# Altium project VibinTest1.PrjPcb
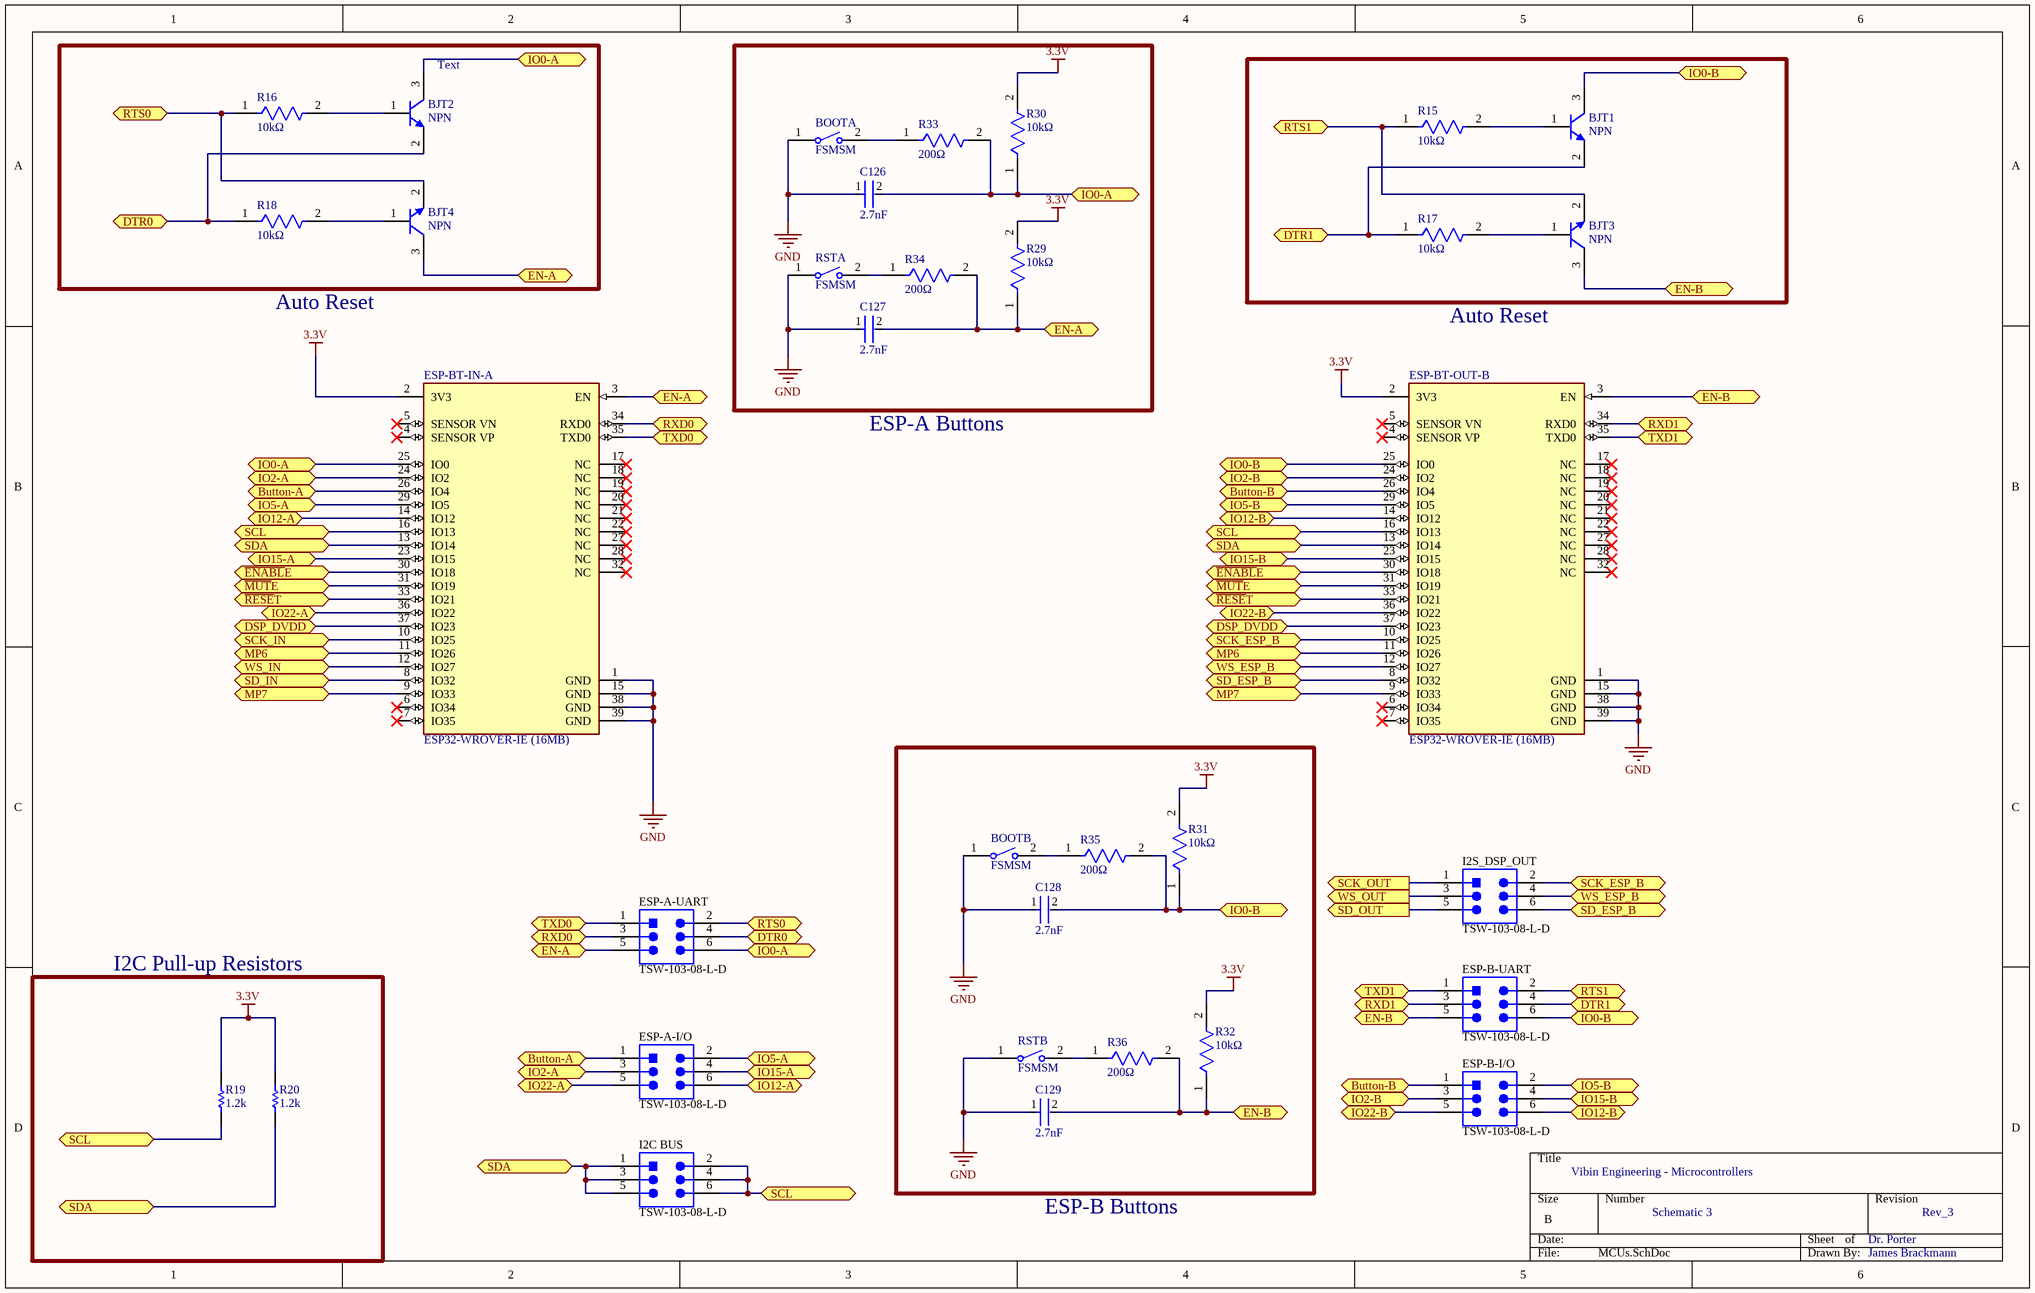
[diagram p0: MCUs.SchDoc]
2 sheets, 61 parts. Net scope: flat (ports and power ports of the same name join across sheets).
Board file: VibinDraft.PcbDoc
Sheets:
  MCUs.SchDoc
  Amplifier_1.SchDoc

## Sheet MCUs.SchDoc
size B; SheetNumber: 5; SheetTotal: 7

### Parts
BJT1  NPN  [ONSC-SOT-23-3-318-08_V]
BJT2  NPN  [ONSC-SOT-23-3-318-08_V]
BJT3  NPN  [ONSC-SOT-23-3-318-08_V]
BJT4  NPN  [ONSC-SOT-23-3-318-08_V]
BOOTA  FSMSM  [TECO-FSMSM-2_V]
BOOTB  FSMSM  [TECO-FSMSM-2_V]
C126  2.7nF  [FP-C0402-BB-MFG]
C127  2.7nF  [FP-C0402-BB-MFG]
C128  2.7nF  [FP-C0402-BB-MFG]
C129  2.7nF  [FP-C0402-BB-MFG]
ESP-A-I/O  TSW-103-08-L-D  [SMTC-TSW-103-08-L-D_V]
ESP-A-UART  TSW-103-08-L-D  [SMTC-TSW-103-08-L-D_V]
ESP-B-I/O  TSW-103-08-L-D  [SMTC-TSW-103-08-L-D_V]
ESP-B-UART  TSW-103-08-L-D  [SMTC-TSW-103-08-L-D_V]
ESP-BT-IN-A  ESP32-WROVER-IE (16MB)  [FP-ESP32-WROVER-IE_16MB-MFG]
ESP-BT-OUT-B  ESP32-WROVER-IE (16MB)  [FP-ESP32-WROVER-IE_16MB-MFG]
I2C_BUS  TSW-103-08-L-D  [SMTC-TSW-103-08-L-D_V]
I2S_DSP_OUT  TSW-103-08-L-D  [SMTC-TSW-103-08-L-D_V]
R15  10kΩ  [FP-RC0603-0_55-IPC_C]
R16  10kΩ  [FP-RC0603-0_55-IPC_C]
R17  10kΩ  [FP-RC0603-0_55-IPC_C]
R18  10kΩ  [FP-RC0603-0_55-IPC_C]
R19  1.2k  [RESC1608X55X25LL10T15]
R20  1.2k  [RESC1608X55X25LL10T15]
R29  10kΩ  [FP-RC0603-0_55-IPC_C]
R30  10kΩ  [FP-RC0603-0_55-IPC_C]
R31  10kΩ  [FP-RC0603-0_55-IPC_C]
R32  10kΩ  [FP-RC0603-0_55-IPC_C]
R33  200Ω  [FP-ERJ2RK-IPC_A]
R34  200Ω  [FP-ERJ2RK-IPC_A]
R35  200Ω  [FP-ERJ2RK-IPC_A]
R36  200Ω  [FP-ERJ2RK-IPC_A]
RSTA  FSMSM  [TECO-FSMSM-2_V]
RSTB  FSMSM  [TECO-FSMSM-2_V]

### Blocks framed on the sheet
Text: BJT2 BJT4 R16 R18
I2C Pull-up Resistors: R19 R20

### Ports
Button-A (bidir), Button-B (bidir), DSP_DVDD (bidir), DTR0 (bidir), DTR1 (bidir), EN-A (bidir), EN-B (bidir), IO0-A (bidir), IO0-B (bidir), IO2-A (bidir), IO2-B (bidir), IO5-A (bidir), IO5-B (bidir), IO12-A (bidir), IO12-B (bidir), IO15-A (bidir), IO15-B (bidir), IO22-A (bidir), IO22-B (bidir), MP6 (bidir), MP7 (bidir), RTS0 (bidir), RTS1 (bidir), RXD0 (bidir), RXD1 (bidir), SCK_ESP_B (bidir), SCK_IN (bidir), SCK_OUT (out), SCL (bidir), SD_ESP_B (bidir), SD_IN (bidir), SD_OUT (out), SDA (bidir), TXD0 (bidir), TXD1 (bidir), WS_ESP_B (bidir), WS_IN (bidir), WS_OUT (out), ~{ENABL}E (bidir), ~{MUT}E (bidir), ~{RESE}T (bidir)

### Nets
3.3V: ESP-BT-IN-A.2(3V3) ESP-BT-OUT-B.2(3V3) R19.2 R20.2 R29.2 R30.2 R31.2 R32.2
GND: BOOTA.1 BOOTB.1 C126.1 C127.1 C128.1 C129.1 ESP-BT-IN-A.1(GND) ESP-BT-IN-A.15(GND) ESP-BT-IN-A.38(GND) ESP-BT-IN-A.39(GND) ESP-BT-OUT-B.1(GND) ESP-BT-OUT-B.15(GND) ESP-BT-OUT-B.38(GND) ESP-BT-OUT-B.39(GND) RSTA.1 RSTB.1  [project net AVSS]
NetAMP1_27: ESP-BT-IN-A.16(IO13) ESP-BT-OUT-B.16(IO13) I2C_BUS.2 I2C_BUS.4 I2C_BUS.6 R19.1 ; port SCL
NetAMP1_30: ESP-BT-IN-A.13(IO14) ESP-BT-OUT-B.13(IO14) I2C_BUS.1 I2C_BUS.3 I2C_BUS.5 R20.1 ; port SDA
NetAMP1_33: ESP-BT-IN-A.30(IO18) ESP-BT-OUT-B.30(IO18) ; port ~{ENABL}E
NetAMP1_34: ESP-BT-IN-A.31(IO19) ESP-BT-OUT-B.31(IO19) ; port ~{MUT}E
NetBJT1_1: BJT1.1(B) R15.2
NetBJT1_2: BJT1.2(E) ESP-B-UART.4 R17.1 ; port DTR1
NetBJT1_3: BJT1.3(C) C128.2 ESP-B-UART.6 ESP-BT-OUT-B.25(IO0) R31.1 R35.2 ; port IO0-B
NetBJT2_1: BJT2.1(B) R16.2
NetBJT2_2: BJT2.2(E) ESP-A-UART.4 R18.1 ; port DTR0
NetBJT2_3: BJT2.3(C) C126.2 ESP-A-UART.6 ESP-BT-IN-A.25(IO0) R30.1 R33.2 ; port IO0-A
NetBJT3_1: BJT3.1(B) R17.2
NetBJT3_2: BJT3.2(E) ESP-B-UART.2 R15.1 ; port RTS1
NetBJT3_3: BJT3.3(C) C129.2 ESP-B-UART.5 ESP-BT-OUT-B.3(EN) R32.1 R36.2 ; port EN-B
NetBJT4_1: BJT4.1(B) R18.2
NetBJT4_2: BJT4.2(E) ESP-A-UART.2 R16.1 ; port RTS0
NetBJT4_3: BJT4.3(C) C127.2 ESP-A-UART.5 ESP-BT-IN-A.3(EN) R29.1 R34.2 ; port EN-A
NetBOOTA_2: BOOTA.2 R33.1
NetBOOTB_2: BOOTB.2 R35.1
NetESP-A-I/O_1: ESP-A-I/O.1 ESP-BT-IN-A.26(IO4) ; port Button-A
NetESP-A-I/O_2: ESP-A-I/O.2 ESP-BT-IN-A.29(IO5) ; port IO5-A
NetESP-A-I/O_3: ESP-A-I/O.3 ESP-BT-IN-A.24(IO2) ; port IO2-A
NetESP-A-I/O_4: ESP-A-I/O.4 ESP-BT-IN-A.23(IO15) ; port IO15-A
NetESP-A-I/O_5: ESP-A-I/O.5 ESP-BT-IN-A.36(IO22) ; port IO22-A
NetESP-A-I/O_6: ESP-A-I/O.6 ESP-BT-IN-A.14(IO12) ; port IO12-A
NetESP-A-UART_1: ESP-A-UART.1 ESP-BT-IN-A.35(TXD0) ; port TXD0
NetESP-A-UART_3: ESP-A-UART.3 ESP-BT-IN-A.34(RXD0) ; port RXD0
NetESP-B-I/O_1: ESP-B-I/O.1 ESP-BT-OUT-B.26(IO4) ; port Button-B
NetESP-B-I/O_2: ESP-B-I/O.2 ESP-BT-OUT-B.29(IO5) ; port IO5-B
NetESP-B-I/O_3: ESP-B-I/O.3 ESP-BT-OUT-B.24(IO2) ; port IO2-B
NetESP-B-I/O_4: ESP-B-I/O.4 ESP-BT-OUT-B.23(IO15) ; port IO15-B
NetESP-B-I/O_5: ESP-B-I/O.5 ESP-BT-OUT-B.36(IO22) ; port IO22-B
NetESP-B-I/O_6: ESP-B-I/O.6 ESP-BT-OUT-B.14(IO12) ; port IO12-B
NetESP-B-UART_1: ESP-B-UART.1 ESP-BT-OUT-B.35(TXD0) ; port TXD1
NetESP-B-UART_3: ESP-B-UART.3 ESP-BT-OUT-B.34(RXD0) ; port RXD1
NetESP-BT-IN-A_8: ESP-BT-IN-A.8(IO32) ; port SD_IN
NetESP-BT-IN-A_9: ESP-BT-IN-A.9(IO33) ESP-BT-OUT-B.9(IO33) ; port MP7
NetESP-BT-IN-A_10: ESP-BT-IN-A.10(IO25) ; port SCK_IN
NetESP-BT-IN-A_11: ESP-BT-IN-A.11(IO26) ESP-BT-OUT-B.11(IO26) ; port MP6
NetESP-BT-IN-A_12: ESP-BT-IN-A.12(IO27) ; port WS_IN
NetESP-BT-IN-A_33: ESP-BT-IN-A.33(IO21) ESP-BT-OUT-B.33(IO21) ; port ~{RESE}T
NetESP-BT-IN-A_37: ESP-BT-IN-A.37(IO23) ESP-BT-OUT-B.37(IO23) ; port DSP_DVDD
NetESP-BT-OUT-B_8: ESP-BT-OUT-B.8(IO32) I2S_DSP_OUT.6 ; port SD_ESP_B
NetESP-BT-OUT-B_10: ESP-BT-OUT-B.10(IO25) I2S_DSP_OUT.2 ; port SCK_ESP_B
NetESP-BT-OUT-B_12: ESP-BT-OUT-B.12(IO27) I2S_DSP_OUT.4 ; port WS_ESP_B
NetI2S_DSP_OUT_1: I2S_DSP_OUT.1 ; port SCK_OUT
NetI2S_DSP_OUT_3: I2S_DSP_OUT.3 ; port WS_OUT
NetI2S_DSP_OUT_5: I2S_DSP_OUT.5 ; port SD_OUT
NetR34_1: R34.1 RSTA.2
NetR36_1: R36.1 RSTB.2

Not connected (* = marked no-connect by the designer): ESP-BT-IN-A 4(SENSOR_VP)* 5(SENSOR_VN)* 6(IO34)* 7(IO35)* 17(NC)* 18(NC)* 19(NC)* 20(NC)* 21(NC)* 22(NC)* 27(NC)* 28(NC)* 32(NC)*; ESP-BT-OUT-B 4(SENSOR_VP)* 5(SENSOR_VN)* 6(IO34)* 7(IO35)* 17(NC)* 18(NC)* 19(NC)* 20(NC)* 21(NC)* 22(NC)* 27(NC)* 28(NC)* 32(NC)*

### Notes on the sheet
- Auto Reset
- ESP-A Buttons
- Vibin Engineering - Microcontrollers
- ESP-B Buttons
- Schematic 3
- Dr. Porter
- Rev_3
- James Brackmann

### Library data of the parts
BJT1-BJT4 = CMP-1048-00627-1: Amplifier Transistor, NPN Silicon, 3-Pin SOT-23, Pb-Free, Tape and Reel       NSVMMBT6429LT1G; Manufacturer: On Semiconductor; IC Continuous (A): 0.2; fT Min (MHz): 100; ComponentLink3URL: http://www.onsemi.cn/pub_link/Collateral/318-08.PDF; Mounting Technology: Surface Mount; ComponentLink2Description: Datasheet; Polarity: NPN; DatasheetVersion: Rev. 6; PackageReference: SOT-23-3-318-08; Packing: Tape and Reel; PackageVersion: Rev. AP, 11/2009; ComponentLink1URL: http://www.onsemi.com/; ComponentLink3Description: Package Specification; RoHS: TRUE; PackageDescription: 3-Pin Small Outline Transistor, Body 2.92 x 1.3 mm, Pitch 0.95 mm; ComponentLink2URL: http://www.onsemi.com/pub_link/Collateral/MMBT6428LT1-D.PDF; PartNumber: NSVMMBT6429LT1G; ComponentLink1Description: Manufacturer URL
BOOTA BOOTB RSTA RSTB = CMP-2000-07511-1: FSMSM Push Button Switch, 50 mA, -35 to 85 degC, 2-Pin SMD, RoHS, Bulk        506-FSMSM; Manufacturer: TE Connectivity; Actuator Length: 1.07mm; Electrical Life: 20000Cycles; Actuator Material: Polyamide; Current Rating: 50mA; Illumination Type: Illuminated; Voltage Rating (DC): 24V; Contact Resistance: 100mOhm; Case\/Package: SMD/SMT; Operating Force: 180gf; Switch Travel: 0.25mm; Max Voltage Rating (DC): 12V; Throw Configuration: SPST; Packaging: LoosePiece; Max Operating Temperature: 85degC; ELV: Compliant; Package Description: 2-Pin Surface Mount Device, Body 6 x 3.5 mm, Pitch 9.19 mm; RoHSCompliant: true; Manufacturer URL: http://www.te.com/; Contact Plating: Silver; Contact Material: Brass; Mounting Technology: SurfaceMount; Contact Current Rating: 50mA; Datasheet Version: Rev. C2, 08/2014; Datasheet URL: http://www.te.com/commerce/DocumentDelivery/DDEController?Action=showdoc&DocId=Customer+Drawing%7F1437566-3%7FC2%7Fpdf%7FEnglish%7FENG_CD_1437566-3_C2_1437566_3_1_c.dwg.pdf%7F1437566-3; Mechanical Life: 20000Cycles; Package Reference: FSMSM; REACH SVHC: Unknown; Orientation: Straight; Min Operating Temperature: -35degC; Lead Free: LeadFree; Termination: GullWing; Package Quantity: 1000; Mount: SurfaceMount
C126-C129 = CMP-2008-03164-3: C0402 2,700 pF X7R 5.00% 10 V        C0402C272J8RACAUTO; Manufacturer: Kemet; Material: Ceramic; Tolerance: 0.05; Temperature Coefficient: 15%; Voltage Rating: 10 V; Octopart: https://octopart.com/c0402c272j8racauto-kemet-16435644; Manufacturer Part Number: C0402C272J8RACAUTO; Device Class L2: Capacitors; Temperature Range Low: -55°C; Mouser Description: Cap Ceramic 0.0027uF 10V X7R 5% SMD 0402 125°C Bulk; Ipc Land Pattern Name: CAPC10050X50; Device Class L3: Ceramic Capacitors; Lead Free: Yes; Temperature Range High: +125°C; Automotive: No; ComponentLink2URL: https://content.kemet.com/datasheets/KEM_C1002_X7R_SMD.pdf; Temperature: -55°C to +125°C; Height: 0.55mm; RoHS: TRUE; Value: 2,700 pF; Package: C0402-BB; Temperature Characteristic: X7R; Device Class L1: Passive Components; Category: Cap; Capacitance: 2,700 pF; ComponentLink2Description: Datasheet
ESP-A-I/O ESP-A-UART ESP-B-I/O ESP-B-UART I2C_BUS I2S_DSP_OUT = CMP-1024-00336-5: Male Header, Pitch 2.54 mm, 2 x 3 Position, Height 8.38 mm, Tail Length 5.08 mm, -55 to 125 degC, RoHS, Bulk; Manufacturer: Samtec; DatasheetVersion: 04/2012; ComponentLink3URL: http://suddendocs.samtec.com/prints/tsw-xxx-xx-x-x-xx-xxx-footprint.pdf; PackageReference: TSW-103-08-L-D; Mounting Technology: Through Hole; Min Operating Temperature: -55 degC; ComponentLink2Description: Datasheet; Lead Pitch: 2.54 mm; ComponentLink1Description: Manufacturer URL; Mount: Through Hole; ComponentLink1URL: http://www.samtec.com/; ComponentLink3Description: Package Specification; Max Operating Temperature: 125 degC; PackageDescription: Male Header, Pitch 2.54 mm, 2 x 3 Position, Height 8.38 mm, Tail Length 5.08 mm; ComponentLink2URL: https://datasheet.ciiva.com/25618/0900766b81154476-25618436.pdf; RoHSCompliant: true
ESP-BT-IN-A ESP-BT-OUT-B = CMP-194065-000028-1: RX TXRX MOD WIFI EXT IPEX SMD
R15 R16 = CMP-2100-03664-2: RES 10K OHM 1% 1/10W 0603        RC0603FR-0710KL; Voltage Rating: 75V; Voltage Rating (DC): 50V; Resistance: 10kR; Power Rating: 100mW; Temperature Coefficient: 100ppm/°C; Depth: 0.8mm; Termination: SMD/SMT; Resistor Type: Thick Film; Series: RC; Construction: Rectangular; Features: Moisture Resistant; Packaging: Tape and Reel; Min Operating Temperature: -55°C; Number of Terminations: 2; Lead Pitch: 0.3mm; RoHS Compliant: Yes; Case/Package: 0603; Resistance Tolerance: 1%; Military Standard: Not; Weight: 7.1E-05oz; Number of Pins: 2; Tolerance: 1%; Length: 1.6mm; Case Code (Imperial): 0603; Lead Free: Lead Free; Width: 0.8mm; Max Power Dissipation: 100mW; Height: 0.45mm; Max Operating Temperature: 155°C; Case Code (Metric): 1608; Size Code: 0603
R17 R18 R29-R32 = CMP-2100-03664-2: RES 10K OHM 1% 1/10W 0603      RC0603FR-0710KL; Voltage Rating: 75V; Voltage Rating (DC): 50V; Resistance: 10kR; Power Rating: 100mW; Temperature Coefficient: 100ppm/°C; Depth: 0.8mm; Termination: SMD/SMT; Resistor Type: Thick Film; Series: RC; Construction: Rectangular; Features: Moisture Resistant; Packaging: Tape and Reel; Min Operating Temperature: -55°C; Number of Terminations: 2; Lead Pitch: 0.3mm; RoHS Compliant: Yes; Case/Package: 0603; Resistance Tolerance: 1%; Military Standard: Not; Weight: 7.1E-05oz; Number of Pins: 2; Tolerance: 1%; Length: 1.6mm; Case Code (Imperial): 0603; Lead Free: Lead Free; Width: 0.8mm; Max Power Dissipation: 100mW; Height: 0.45mm; Max Operating Temperature: 155°C; Case Code (Metric): 1608; Size Code: 0603
R19 R20 = CMP-1659-00042-1: Chip Resistor, 1.2 KOhm, +/- 1%, 0.1 W, -55 to 155 degC, 0603 (1608 Metric), RoHS, Tape and Reel         RC0603FR-071K2L; Resistance: 825 kohm; Voltage Rating: 50 V; Power Rating: 100 mW; Case\Package: 0603; DatasheetVersion: Rev. 4, 02/2016; Package Quantity: 5000; Min Operating Temperature: -55 degC; PackageReference: 0603; ComponentLink1Description: Manufacturer URL; Tolerance: 1%; ComponentLink2Description: Datasheet; Packaging: Tape and Reel; PackageDescription: 2-Pin Surface Mount Device, Body 1.6 x 0.8 mm; Width: 0.8 mm; ComponentLink2URL: http://www.yageo.com/documents/recent/PYu-RC_Group_51_RoHS_L_04.pdf; ComponentLink1URL: http://www.yageo.com/; Max Operating Temperature: 155 degC; RoHSCompliant: true; Height: 0.45 mm; Case Code (Imperial): 0603; Case Code (Metric): 1608; Length: 1.6 mm
R33-R36 = CMP-2002-00757-2: RES SMD 200 OHM 1% 1/10W 0402    ERJ-2RKF2000X; Power Rating: 100mW; Voltage Rating (DC): 50V; Resistance: 200R; Temperature Coefficient: 100ppm/°C; RoHS Compliant: Yes; Packaging: Tape and Reel; Case Code (Metric): 1005; Package Quantity: 1; Contact Plating: Tin; Series: ERJ; Mount: Surface Mount; Lead Free: Lead Free; Min Operating Temperature: -55°C; Number of Terminations: 2; Max Power Dissipation: 100mW; Technology: THICK FILM; Voltage Rating: 50V; Case/Package: 0402; Width: 0.02inch; Termination: SMD/SMT; Military Standard: Not; Height: 0.35mm; Radiation Hardening: No; Resistance Tolerance: 1%; Length: 1mm; REACH SVHC: No SVHC; Construction: Rectangular; Depth: 0.5mm; Features: Automotive AEC-Q200; Resistor Type: Thick Film; Case Code (Imperial): 0402; Tolerance: 1%; Size Code: 0402; Max Operating Temperature: 155°C

## Sheet Amplifier_1.SchDoc
size B; SheetNumber: 2; SheetTotal: 7; SPICEModelCacheXOIHOEUF: <root> / <DocumentId>XOIHOEUF</DocumentId> / </root>
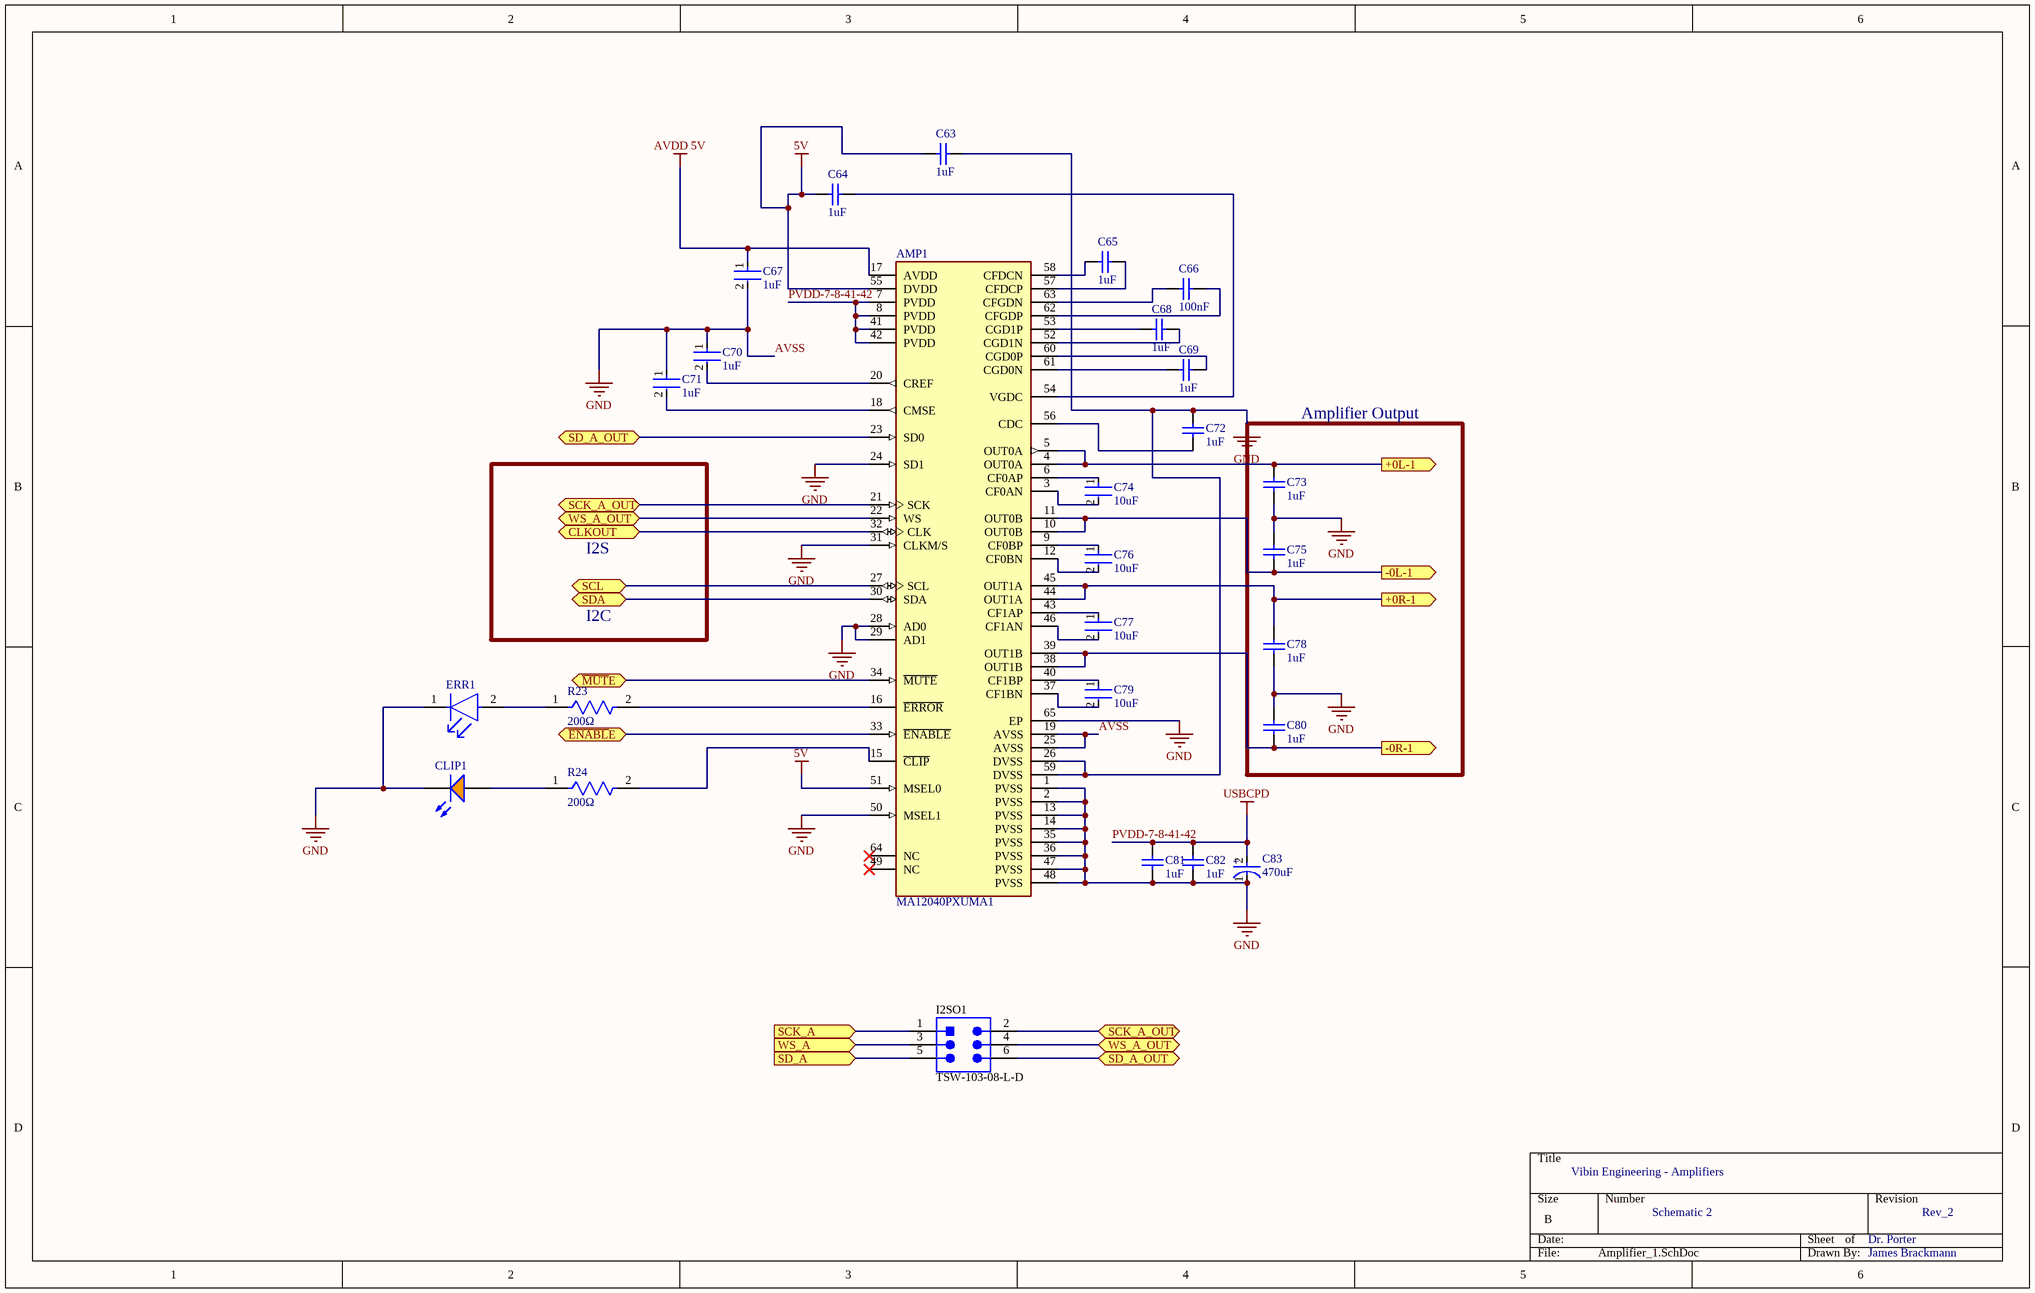
[diagram p1: Amplifier_1.SchDoc]

### Parts
AMP1  MA12040PXUMA1  [FP-PG-VQFN-64-IPC_B]
C63  1uF  [CAPC1608X90X35LL15T15]
C64  1uF  [CAPC1608X90X35LL15T15]
C65  1uF  [CAPC1608X90X35LL15T15]
C66  100nF  [CAPC1608X90X35ML10T15]
C67  1uF  [FP-GRM15-0_1-MFG]
C68  1uF  [CAPC1608X90X35LL15T15]
C69  1uF  [CAPC1608X90X35LL15T15]
C70  1uF  [FP-GRM15-0_1-MFG]
C71  1uF  [FP-GRM15-0_1-MFG]
C72  1uF  [CAPC1608X90X35LL15T15]
C73  1uF  [CAPC1608X90X35LL15T15]
C74  10uF  [FP-1210-L_3_3_0_4-W_2_5_0-MFG]
C75  1uF  [CAPC1608X90X35LL15T15]
C76  10uF  [FP-1210-L_3_3_0_4-W_2_5_0-MFG]
C77  10uF  [FP-1210-L_3_3_0_4-W_2_5_0-MFG]
C78  1uF  [CAPC1608X90X35LL15T15]
C79  10uF  [FP-1210-L_3_3_0_4-W_2_5_0-MFG]
C80  1uF  [CAPC1608X90X35LL15T15]
C81  1uF  [CAPC1608X90X35LL15T15]
C82  1uF  [CAPC1608X90X35LL15T15]
C83  470uF  [FP-OS-CON-SMT-E12-MFG]
CLIP1  TLMO1100-GS08  [VISH-TLMX1100-2_V]  (value not drawn)
ERR1  LTST-C190GKT  [FP-LTST-C190GKT-MFG]  (value not drawn)
I2SO1  TSW-103-08-L-D  [SMTC-TSW-103-08-L-D_V]
R23  200Ω  [FP-ERJ2RK-IPC_A]
R24  200Ω  [FP-ERJ2RK-IPC_A]

### Blocks framed on the sheet
Amplifier Output: C73 C75 C78 C80

### Ports
+0L-1 (out), +0R-1 (out), -0L-1 (out), -0R-1 (out), CLKOUT (bidir), SCK_A (in), SCK_A_OUT (bidir), SCL (bidir), SD_A (in), SD_A_OUT (bidir), SDA (bidir), WS_A (in), WS_A_OUT (bidir), ~{ENABL}E (bidir), ~{MUT}E (bidir)

### Nets
5V: AMP1.51(MSEL0) AMP1.55(DVDD) C63.2 C64.1
AVDD 5V: AMP1.17(AVDD) C67.1
AVSS: AMP1.1(PVSS) AMP1.2(PVSS) AMP1.13(PVSS) AMP1.14(PVSS) AMP1.19(AVSS) AMP1.24(SD1) AMP1.25(AVSS) AMP1.26(DVSS) AMP1.28(AD0) AMP1.29(AD1) AMP1.31(CLKM/S) AMP1.35(PVSS) AMP1.36(PVSS) AMP1.47(PVSS) AMP1.48(PVSS) AMP1.50(MSEL1) AMP1.59(DVSS) AMP1.65(EP) C63.1 C67.2 C70.1 C71.1 C72.1 C73.2 C75.1 C78.2 C80.1 C81.2 C82.2 C83.1(C) CLIP1.2(K) ERR1.1(C)  [also labelled GND]
PVDD-7-8-41-42: AMP1.7(PVDD) AMP1.8(PVDD) AMP1.41(PVDD) AMP1.42(PVDD) C81.1 C82.1 C83.2(A)  [also labelled USBCPD]
NetAMP1_3: AMP1.3(CF0AN) C74.2
NetAMP1_4: AMP1.4(OUT0A) AMP1.5(OUT0A) C73.1 ; port +0L-1
NetAMP1_6: AMP1.6(CF0AP) C74.1
NetAMP1_9: AMP1.9(CF0BP) C76.1
NetAMP1_10: AMP1.10(OUT0B) AMP1.11(OUT0B) C75.2 ; port -0L-1
NetAMP1_12: AMP1.12(CF0BN) C76.2
NetAMP1_15: AMP1.15(~{CLIP}) R24.2
NetAMP1_16: AMP1.16(~{ERROR}) R23.2
NetAMP1_18: AMP1.18(CMSE) C71.2
NetAMP1_20: AMP1.20(CREF) C70.2
NetAMP1_21: AMP1.21(SCK) I2SO1.2 ; port SCK_A_OUT
NetAMP1_22: AMP1.22(WS) I2SO1.4 ; port WS_A_OUT
NetAMP1_23: AMP1.23(SD0) I2SO1.6 ; port SD_A_OUT
NetAMP1_27: AMP1.27(SCL) ; port SCL
NetAMP1_30: AMP1.30(SDA) ; port SDA
NetAMP1_32: AMP1.32(CLK) ; port CLKOUT
NetAMP1_33: AMP1.33(~{ENABLE}) ; port ~{ENABL}E
NetAMP1_34: AMP1.34(~{MUTE}) ; port ~{MUT}E
NetAMP1_37: AMP1.37(CF1BN) C79.2
NetAMP1_38: AMP1.38(OUT1B) AMP1.39(OUT1B) C80.2 ; port -0R-1
NetAMP1_40: AMP1.40(CF1BP) C79.1
NetAMP1_43: AMP1.43(CF1AP) C77.1
NetAMP1_44: AMP1.44(OUT1A) AMP1.45(OUT1A) C78.1 ; port +0R-1
NetAMP1_46: AMP1.46(CF1AN) C77.2
NetAMP1_52: AMP1.52(CGD1N) C68.1
NetAMP1_53: AMP1.53(CGD1P) C68.2
NetAMP1_54: AMP1.54(VGDC) C64.2
NetAMP1_56: AMP1.56(CDC) C72.2
NetAMP1_57: AMP1.57(CFDCP) C65.1
NetAMP1_58: AMP1.58(CFDCN) C65.2
NetAMP1_60: AMP1.60(CGD0P) C69.1
NetAMP1_61: AMP1.61(CGD0N) C69.2
NetAMP1_62: AMP1.62(CFGDP) C66.1
NetAMP1_63: AMP1.63(CFGDN) C66.2
NetCLIP1_1: CLIP1.1(A) R24.1
NetERR1_2: ERR1.2(A) R23.1
NetI2SO1_1: I2SO1.1 ; port SCK_A
NetI2SO1_3: I2SO1.3 ; port WS_A
NetI2SO1_5: I2SO1.5 ; port SD_A

Not connected (* = marked no-connect by the designer): AMP1 49(NC)* 64(NC)*

### Notes on the sheet
- I2S
- I2C
- Vibin Engineering - Amplifiers
- Schematic 2
- Dr. Porter
- Rev_2
- James Brackmann
- (in symbol CMP-05428-001033-1) +

### Library data of the parts
AMP1 = CMP-32833-000001-1: IC AMP CLASS D STEREO 40W 64QFN; Manufacturer: Infineon; Max Junction Temp: +150°C; Max Supply Voltage: 18V; Output Current Per Channel: 6A; Number Of Channels: 1; Min Supply Voltage: 4V; Nominal Supply Current: 6-38mA; Power At Speaker R: 20W @ 8Ω; Ambient Temperature Range High: +85°C; Ambient Temperature Range Low: 0°C; RoHS: TRUE; Temperature: -40°C to +150°C; Device Class L1: Integrated Circuits (ICs); Height: 0.9mm; Lead Free: Yes; Octopart: https://octopart.com/ma12040pxuma1-infineon-95984592; ComponentLink2URL: https://www.infineon.com/dgdl/Infineon-MA12040P-DS-v01_00-EN.pdf?fileId=5546d46264a8de7e0164b74ff0e561a2; Category: IC; Manufacturer Part Number: MA12040PXUMA1; Temperature Range High: +150°C; Ipc Land Pattern Name: QFN50P900X900X90-64; Automotive: No; Digikey Description: IC AMP CLASS D STEREO 40W 64QFN; Device Class L2: Linear ICs; Device Class L3: Amplifiers - Audio; Temperature Range Low: -40°C; Footprint Url: https://www.infineon.com/cms/en/product/packages/PG-VQFN/PG-VQFN-64-6/; ComponentLink2Description: Datasheet; Package: PG-VQFN-64
C63-C65 C68 C69 C72 C73 C75 C78 C80-C82 = CMP-2006-02298-2: C0603C105K4RACTU; Manufacturer: Kemet; Part Number: C0603C105K4RACTU
C66 = CMP-2100-03643-1: Chip Capacitor, 0.1 uF, +/- 10%, 50 V, -55 to 125 degC, 0603 (1608 Metric), RoHS, Tape and Reel              GRM188R71H104KA93D; Manufacturer: Murata; Dielectric Material: Ceramic; Voltage Rating: 50V; Dielectric: X7R; Insulation Resistance: 10GR; Case Code (Metric): 1608; Lead Free: LeadFree; Depth: 0.8mm; Number of Pins: 2; Radiation Hardening: No; Case/Package: 0603; Manufacturer URL: http://www.murata.com/; Packaging: TapeandReel; Length: 1.6mm; Contact Plating: Tin; Datasheet URL: http://psearch.en.murata.com/capacitor/product/GRM188R71H104KA93%23.pdf; Tolerance: 10%; Case Code (Imperial): 0603; Min Operating Temperature: -55degC; RoHSCompliant: true; Capacitance: 100nF; Voltage: 50V; Termination: SMD/SMT; Mount: SurfaceMount; Material: Ceramic; Package Quantity: 1; Height: 0.8mm; Thickness: 0.035inch; REACH SVHC: NoSVHC; Max Operating Temperature: 125degC; Width: 0.8mm; Package Reference: 0603; Voltage Rating (DC): 50V; Datasheet Version: 42675.0; Package Description: 2-Pin Surface Mount Device, Body 1.6 x 0.8 mm
C67 C70 C71 = CMP-2008-04556-2: CAP CER 1UF 10V X5R 0402         GRM155R61A105KE15D; Manufacturer: Murata; Material: Ceramic; Tolerance: 10%; Temperature Coefficient: 15%; Octopart: https://octopart.com/grm155r61a105ke15d-murata-197442; Manufacturer Part Number: GRM155R61A105KE15D; Lead Free: Yes; ComponentLink2Description: Datasheet; Temperature: -55°C to +85°C; Temperature Range High: +85°C; Height: 0.55mm; Capacitance: 1uF; Ipc Land Pattern Name: CAPC10050X50; ComponentLink2URL: https://search.murata.co.jp/Ceramy/image/img/A01X/G101/ENG/GRM155R61A105KE15-01A.pdf; Temperature Range Low: -55°C; Device Class L2: Capacitors; Voltage Rating: 10V; RoHS: TRUE; Device Class L1: Passive Components; Device Class L3: Ceramic Capacitors; Temperature Characteristic: X5R; Mouser Description: 0402 1 uF 10 V ±10% Tolerance X5R Surface Mount Multilayer Ceramic Capacitor; Automotive: No; Package: GRM15-0.1; Digikey Description: CAP CER 1UF 10V X5R 0402; Value: 1uF; Category: Cap
C74 C76 C77 C79 = CMP-2000-05477-2: General Purpose Ceramic Capacitor, 1210, 10uF, 10%, X5R, 15%, 25V        12103D106KAT2A; Lead Free: Lead Free; Max Operating Temperature: 85°C; REACH SVHC: No SVHC; Depth: 2.5mm; Packaging: Tape and Reel; Min Operating Temperature: -55°C; Height: 2.29mm; Construction: Flat; Case Code (Imperial): 1210; Radiation Hardening: No; Voltage: 25V; Case/Package: 1210; Series: -; Dielectric: X5R; Length: 3.2mm; Thickness: 0.11inch; Package Quantity: 1; Termination: SMD/SMT; Case Code (Metric): 3225; Voltage Rating (DC): 25V; Voltage Rating: 25V; Contact Plating: Tin; RoHS Compliant: Yes; Mount: Surface Mount; Width: 0.098inch; Capacitance: 10uF; Tolerance: 10%
C83 = CMP-05428-001033-1: Conductive Polymer Aluminum Solid Capacitors (OS-CON) 470uF ±20% 20V      20SVPK470M; ESR (Equivalent Series Resistance): 14mR; Life (Hours): 1000Hour; Capacitance: 470uF; Mount: Surface Mount; Max Operating Temperature: 125°C; Min Operating Temperature: -55°C; Case/Package: Radial; Tolerance: 20%; Voltage Rating: 20V; Packaging: Tape and Reel
CLIP1 = CMP-1666-00029-1: Orange LED, 20 mA, 2.1 V, -40 to 100 degC, 2-Pin SMD (0603), RoHS, Tape and Reel           TLMO1100-GS08; Forward Voltage: 1 V; Forward Current: 150 mA; Capacitance: -323 f; Recovery Time: 4 ns; Peak Reverse Current: 5 uA; ComponentLink1URL: http://www.vishay.com/; Width: 1.35 mm; PackageReference: 0603; Min Operating Temperature: -55 degC; Packaging: Tape and Reel; RoHSCompliant: true; ComponentLink2Description: Datasheet; PackageDescription: 2-Pin Surface Mount Device, Body 1.6 x 0.8 mm; DatasheetVersion: Rev. 2.7, 03/2016; Pins: 2; Max Operating Temperature: 150 degC; Radiation Hardening: No; Package Quantity: 3000; ComponentLink1Description: Manufacturer URL; Mount: Surface Mount; REACH SVHC: No SVHC; Length: 1.8 mm; ComponentLink2URL: http://download.siliconexpert.com/pdfs/2016/8/7/12/43/26/667/vsh_/manual/379263299541529tlmb1100.pdf; Height: 1 mm
ERR1 = CMP-22017-000005-2: LED GREEN CLEAR CHIP SMD       LTST-C190GKT; Dominant Wavelength: 569nm; Reverse Voltage: 5V; Lens Color: Colorless; Viewing Angle: 130°; Voltage: 2V; Forward Current: 30mA; Power Dissipation: 100mW; Luminous Intensity: 6mcd; Number of LEDs: 1; Forward Voltage: 2.1V; Wavelength: 565nm; Test Current: 10mA; Min Operating Temperature: -55°C; Lens Style: Clear; Mount: Surface Mount; Width: 0.8mm; Packaging: Tape and Reel; Lens Transparency: Clear; Case Code (Metric): 1608; Depth: 0.8mm; Case Code (Imperial): 0603; Case/Package: 0603; Number of Pins: 2; Max Operating Temperature: 85°C; Lead Free: Lead Free; Number of Elements: 1; Length: 1.6mm; Height: 0.8mm; Package Quantity: 1; Power Rating: 100mW; Radiation Hardening: No; Illumination Color: Green; Color: Green
I2SO1 = CMP-1024-00336-5: as ESP-A-I/O on sheet MCUs; DatasheetVersion: 04/2012; ComponentLink3URL: http://suddendocs.samtec.com/prints/tsw-xxx-xx-x-x-xx-xxx-footprint.pdf; PackageReference: TSW-103-08-L-D; Mounting Technology: Through Hole; Min Operating Temperature: -55 degC; ComponentLink2Description: Datasheet; Lead Pitch: 2.54 mm; ComponentLink1Description: Manufacturer URL; Mount: Through Hole; ComponentLink1URL: http://www.samtec.com/; ComponentLink3Description: Package Specification; Max Operating Temperature: 125 degC; PackageDescription: Male Header, Pitch 2.54 mm, 2 x 3 Position, Height 8.38 mm, Tail Length 5.08 mm; ComponentLink2URL: https://datasheet.ciiva.com/25618/0900766b81154476-25618436.pdf; RoHSCompliant: true
R23 = CMP-2002-00757-2: RES SMD 200 OHM 1% 1/10W 0402      ERJ-2RKF2000X; Power Rating: 100mW; Voltage Rating (DC): 50V; Resistance: 200R; Temperature Coefficient: 100ppm/°C; RoHS Compliant: Yes; Packaging: Tape and Reel; Case Code (Metric): 1005; Package Quantity: 1; Contact Plating: Tin; Series: ERJ; Mount: Surface Mount; Lead Free: Lead Free; Min Operating Temperature: -55°C; Number of Terminations: 2; Max Power Dissipation: 100mW; Technology: THICK FILM; Voltage Rating: 50V; Case/Package: 0402; Width: 0.02inch; Termination: SMD/SMT; Military Standard: Not; Height: 0.35mm; Radiation Hardening: No; Resistance Tolerance: 1%; Length: 1mm; REACH SVHC: No SVHC; Construction: Rectangular; Depth: 0.5mm; Features: Automotive AEC-Q200; Resistor Type: Thick Film; Case Code (Imperial): 0402; Tolerance: 1%; Size Code: 0402; Max Operating Temperature: 155°C
R24 = CMP-2002-00757-2: as R33 on sheet MCUs; RoHS Compliant: Yes; Packaging: Tape and Reel; Case Code (Metric): 1005; Package Quantity: 1; Contact Plating: Tin; Series: ERJ; Mount: Surface Mount; Lead Free: Lead Free; Min Operating Temperature: -55°C; Number of Terminations: 2; Max Power Dissipation: 100mW; Technology: THICK FILM; Voltage Rating: 50V; Case/Package: 0402; Width: 0.02inch; Termination: SMD/SMT; Military Standard: Not; Height: 0.35mm; Radiation Hardening: No; Resistance Tolerance: 1%; Length: 1mm; REACH SVHC: No SVHC; Construction: Rectangular; Depth: 0.5mm; Features: Automotive AEC-Q200; Resistor Type: Thick Film; Case Code (Imperial): 0402; Tolerance: 1%; Size Code: 0402; Max Operating Temperature: 155°C

## Nets that join several sheets
AVSS: MCUs (16 pins), Amplifier_1 (32 pins)
NetAMP1_27: MCUs (6 pins), Amplifier_1 (AMP1.27)
NetAMP1_30: MCUs (6 pins), Amplifier_1 (AMP1.30)
NetAMP1_33: MCUs (ESP-BT-IN-A.30 ESP-BT-OUT-B.30), Amplifier_1 (AMP1.33)
NetAMP1_34: MCUs (ESP-BT-IN-A.31 ESP-BT-OUT-B.31), Amplifier_1 (AMP1.34)